# Altium schematic sheet TMS320F28379D_I2C.SchDoc
size A4
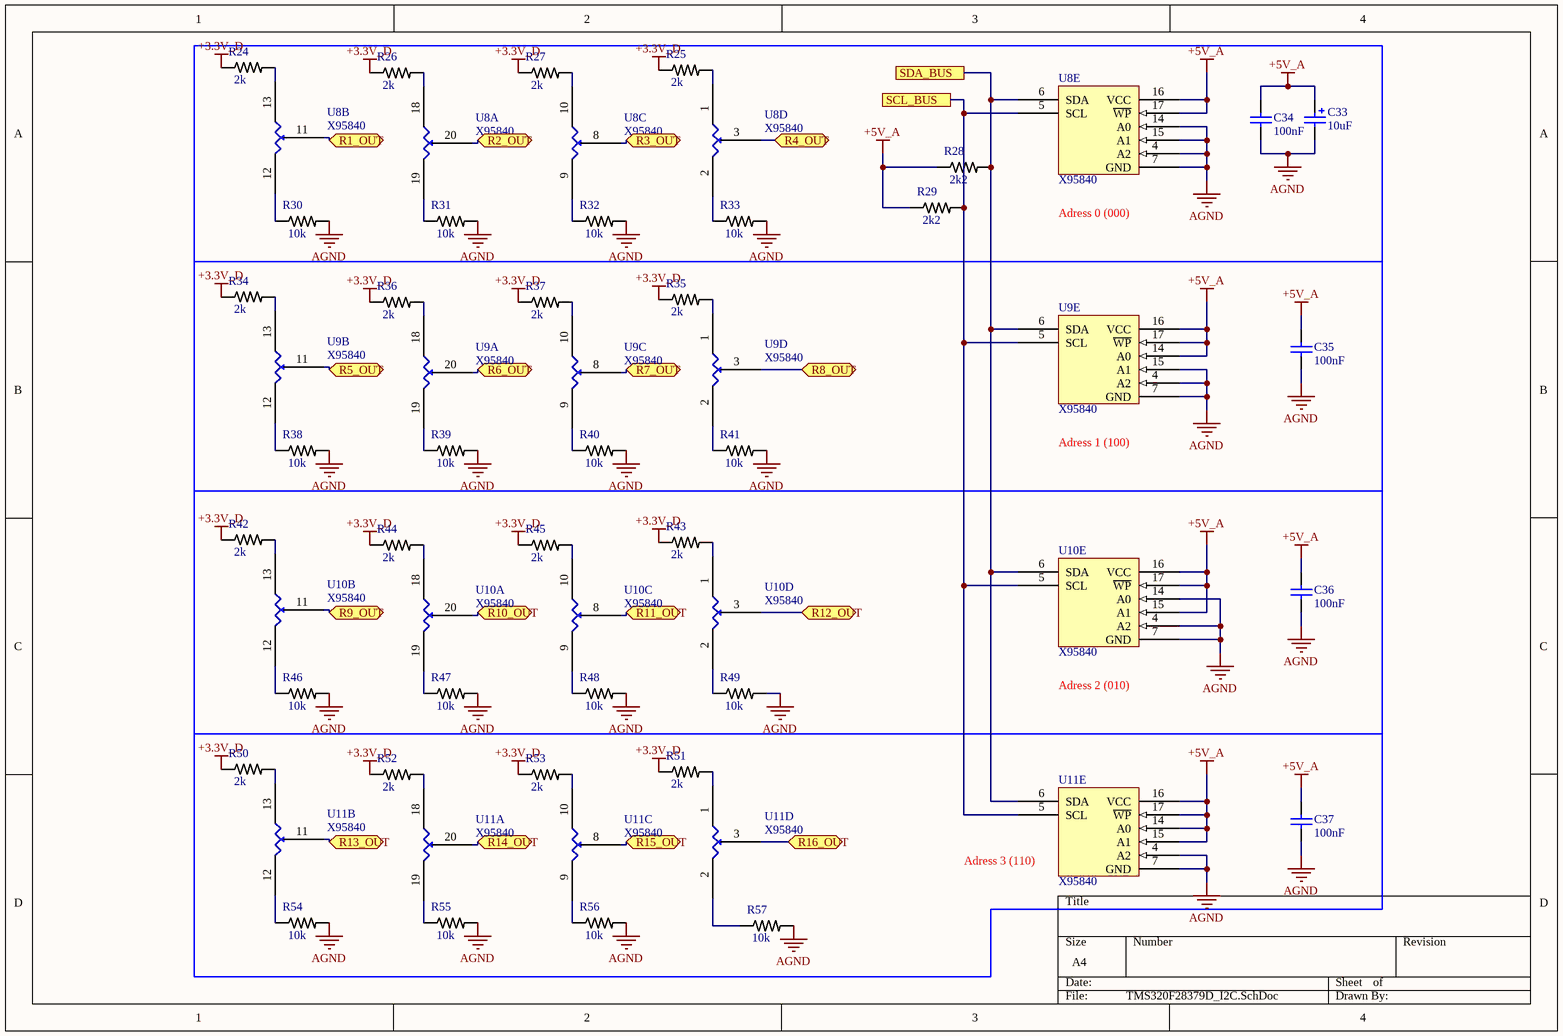
[diagram p0: TMS320F28379D_I2C.SchDoc]

## Parts
C33  value 10uF  [Cap tantalio B]  (hidden comment: Cap polarizado)
C34  value 100nF  [CAP 0805]  (hidden comment: Cap cerámico)
C35  value 100nF  [CAP 0805]  (hidden comment: Cap cerámico)
C36  value 100nF  [CAP 0805]  (hidden comment: Cap cerámico)
C37  value 100nF  [CAP 0805]  (hidden comment: Cap cerámico)
R24  value 2k  [Resistor 0805]  (hidden comment: Resistor 0805)
R25  value 2k  [Resistor 0805]  (hidden comment: Resistor 0805)
R26  value 2k  [Resistor 0805]  (hidden comment: Resistor 0805)
R27  value 2k  [Resistor 0805]  (hidden comment: Resistor 0805)
R28  value 2k2  [Resistor 0805]  (hidden comment: Resistor 0805)
R29  value 2k2  [Resistor 0805]  (hidden comment: Resistor 0805)
R30  value 10k  [Resistor 0805]  (hidden comment: Resistor 0805)
R31  value 10k  [Resistor 0805]  (hidden comment: Resistor 0805)
R32  value 10k  [Resistor 0805]  (hidden comment: Resistor 0805)
R33  value 10k  [Resistor 0805]  (hidden comment: Resistor 0805)
R34  value 2k  [Resistor 0805]  (hidden comment: Resistor 0805)
R35  value 2k  [Resistor 0805]  (hidden comment: Resistor 0805)
R36  value 2k  [Resistor 0805]  (hidden comment: Resistor 0805)
R37  value 2k  [Resistor 0805]  (hidden comment: Resistor 0805)
R38  value 10k  [Resistor 0805]  (hidden comment: Resistor 0805)
R39  value 10k  [Resistor 0805]  (hidden comment: Resistor 0805)
R40  value 10k  [Resistor 0805]  (hidden comment: Resistor 0805)
R41  value 10k  [Resistor 0805]  (hidden comment: Resistor 0805)
R42  value 2k  [Resistor 0805]  (hidden comment: Resistor 0805)
R43  value 2k  [Resistor 0805]  (hidden comment: Resistor 0805)
R44  value 2k  [Resistor 0805]  (hidden comment: Resistor 0805)
R45  value 2k  [Resistor 0805]  (hidden comment: Resistor 0805)
R46  value 10k  [Resistor 0805]  (hidden comment: Resistor 0805)
R47  value 10k  [Resistor 0805]  (hidden comment: Resistor 0805)
R48  value 10k  [Resistor 0805]  (hidden comment: Resistor 0805)
R49  value 10k  [Resistor 0805]  (hidden comment: Resistor 0805)
R50  value 2k  [Resistor 0805]  (hidden comment: Resistor 0805)
R51  value 2k  [Resistor 0805]  (hidden comment: Resistor 0805)
R52  value 2k  [Resistor 0805]  (hidden comment: Resistor 0805)
R53  value 2k  [Resistor 0805]  (hidden comment: Resistor 0805)
R54  value 10k  [Resistor 0805]  (hidden comment: Resistor 0805)
R55  value 10k  [Resistor 0805]  (hidden comment: Resistor 0805)
R56  value 10k  [Resistor 0805]  (hidden comment: Resistor 0805)
R57  value 10k  [Resistor 0805]  (hidden comment: Resistor 0805)
U8  X95840  [20-TSSOP]  (parts A,B,C,D,E of 5)
U9  X95840  [20-TSSOP]  (parts A,B,C,D,E of 5)
U10  X95840  [20-TSSOP]  (parts A,B,C,D,E of 5)
U11  X95840  [20-TSSOP]  (parts A,B,C,D,E of 5)

## Ports
R1_OUT, R2_OUT, R3_OUT, R4_OUT, R5_OUT, R6_OUT, R7_OUT, R8_OUT, R9_OUT, R10_OUT, R11_OUT, R12_OUT, R13_OUT, R14_OUT, R15_OUT, R16_OUT, SCL_BUS, SDA_BUS

## Nets
+3.3V_D: R24.1 R25.1 R26.1 R27.1 R34.1 R35.1 R36.1 R37.1 R42.1 R43.1 R44.1 R45.1 R50.1 R51.1 R52.1 R53.1
+5V_A: C33.1 C34.1 C35.1 C36.1 C37.1 R28.1 R29.1 U8.16(VCC) U8.17(~{WP}) U9.14(A0) U9.16(VCC) U9.17(~{WP}) U10.15(A1) U10.16(VCC) U10.17(~{WP}) U11.14(A0) U11.15(A1) U11.16(VCC) U11.17(~{WP})
AGND: C33.2 C34.2 C35.2 C36.2 C37.2 R30.2 R31.2 R32.2 R33.2 R38.2 R39.2 R40.2 R41.2 R46.2 R47.2 R48.2 R49.2 R54.2 R55.2 R56.2 R57.2 U8.4(A2) U8.7(GND) U8.14(A0) U8.15(A1) U9.4(A2) U9.7(GND) U9.15(A1) U10.4(A2) U10.7(GND) U10.14(A0) U11.4(A2) U11.7(GND)
R1_OUT: U8.11(RW1) ; port R1_OUT
R2_OUT: U8.20 ; port R2_OUT
R3_OUT: U8.8(RW2) ; port R3_OUT
R4_OUT: U8.3(RW3) ; port R4_OUT
R5_OUT: U9.11(RW1) ; port R5_OUT
R6_OUT: U9.20 ; port R6_OUT
R7_OUT: U9.8(RW2) ; port R7_OUT
R8_OUT: U9.3(RW3) ; port R8_OUT
R9_OUT: U10.11(RW1) ; port R9_OUT
R10_OUT: U10.20 ; port R10_OUT
R11_OUT: U10.8(RW2) ; port R11_OUT
R12_OUT: U10.3(RW3) ; port R12_OUT
R13_OUT: U11.11(RW1) ; port R13_OUT
R14_OUT: U11.20 ; port R14_OUT
R15_OUT: U11.8(RW2) ; port R15_OUT
R16_OUT: U11.3(RW3) ; port R16_OUT
SCL_BUS: R29.2 U8.5(SCL) U9.5(SCL) U10.5(SCL) U11.5(SCL) ; port SCL_BUS
SDA_BUS: R28.2 U8.6(SDA) U9.6(SDA) U10.6(SDA) U11.6(SDA) ; port SDA_BUS
NetR24_2: R24.2 U8.13(RH1)
NetR25_2: R25.2 U8.1(RH3)
NetR26_2: R26.2 U8.18
NetR27_2: R27.2 U8.10(RH2)
NetR30_1: R30.1 U8.12(RL1)
NetR31_1: R31.1 U8.19
NetR32_1: R32.1 U8.9(RL2)
NetR33_1: R33.1 U8.2(RL3)
NetR34_2: R34.2 U9.13(RH1)
NetR35_2: R35.2 U9.1(RH3)
NetR36_2: R36.2 U9.18
NetR37_2: R37.2 U9.10(RH2)
NetR38_1: R38.1 U9.12(RL1)
NetR39_1: R39.1 U9.19
NetR40_1: R40.1 U9.9(RL2)
NetR41_1: R41.1 U9.2(RL3)
NetR42_2: R42.2 U10.13(RH1)
NetR43_2: R43.2 U10.1(RH3)
NetR44_2: R44.2 U10.18
NetR45_2: R45.2 U10.10(RH2)
NetR46_1: R46.1 U10.12(RL1)
NetR47_1: R47.1 U10.19
NetR48_1: R48.1 U10.9(RL2)
NetR49_1: R49.1 U10.2(RL3)
NetR50_2: R50.2 U11.13(RH1)
NetR51_2: R51.2 U11.1(RH3)
NetR52_2: R52.2 U11.18
NetR53_2: R53.2 U11.10(RH2)
NetR54_1: R54.1 U11.12(RL1)
NetR55_1: R55.1 U11.19
NetR56_1: R56.1 U11.9(RL2)
NetR57_1: R57.1 U11.2(RL3)

## Notes on the sheet
- (near U8) Adress 0 (000)
- (near U9) Adress 1 (100)
- (near U10) Adress 2 (010)
- (near U11) Adress 3 (110)

## Library data of the parts
R24-R57 = Resistor: Digi-Key Part Number: *; Manufacturer Part Number: *
U8-U11 = X95840: Manufacturer Part Number: X95840WV20IZ-2.7; Código de producto RS: 100-0181; Digi-Key Part Number: X95840WV20IZ-2.7-ND
C33 = Cap polarizado: Digi-Key Part Number: *; Manufacturer Part Number: *
C34-C37 = Cap cerámico: Digi-Key Part Number: *; Manufacturer Part Number: *